# Altium project KRing.PrjPCB
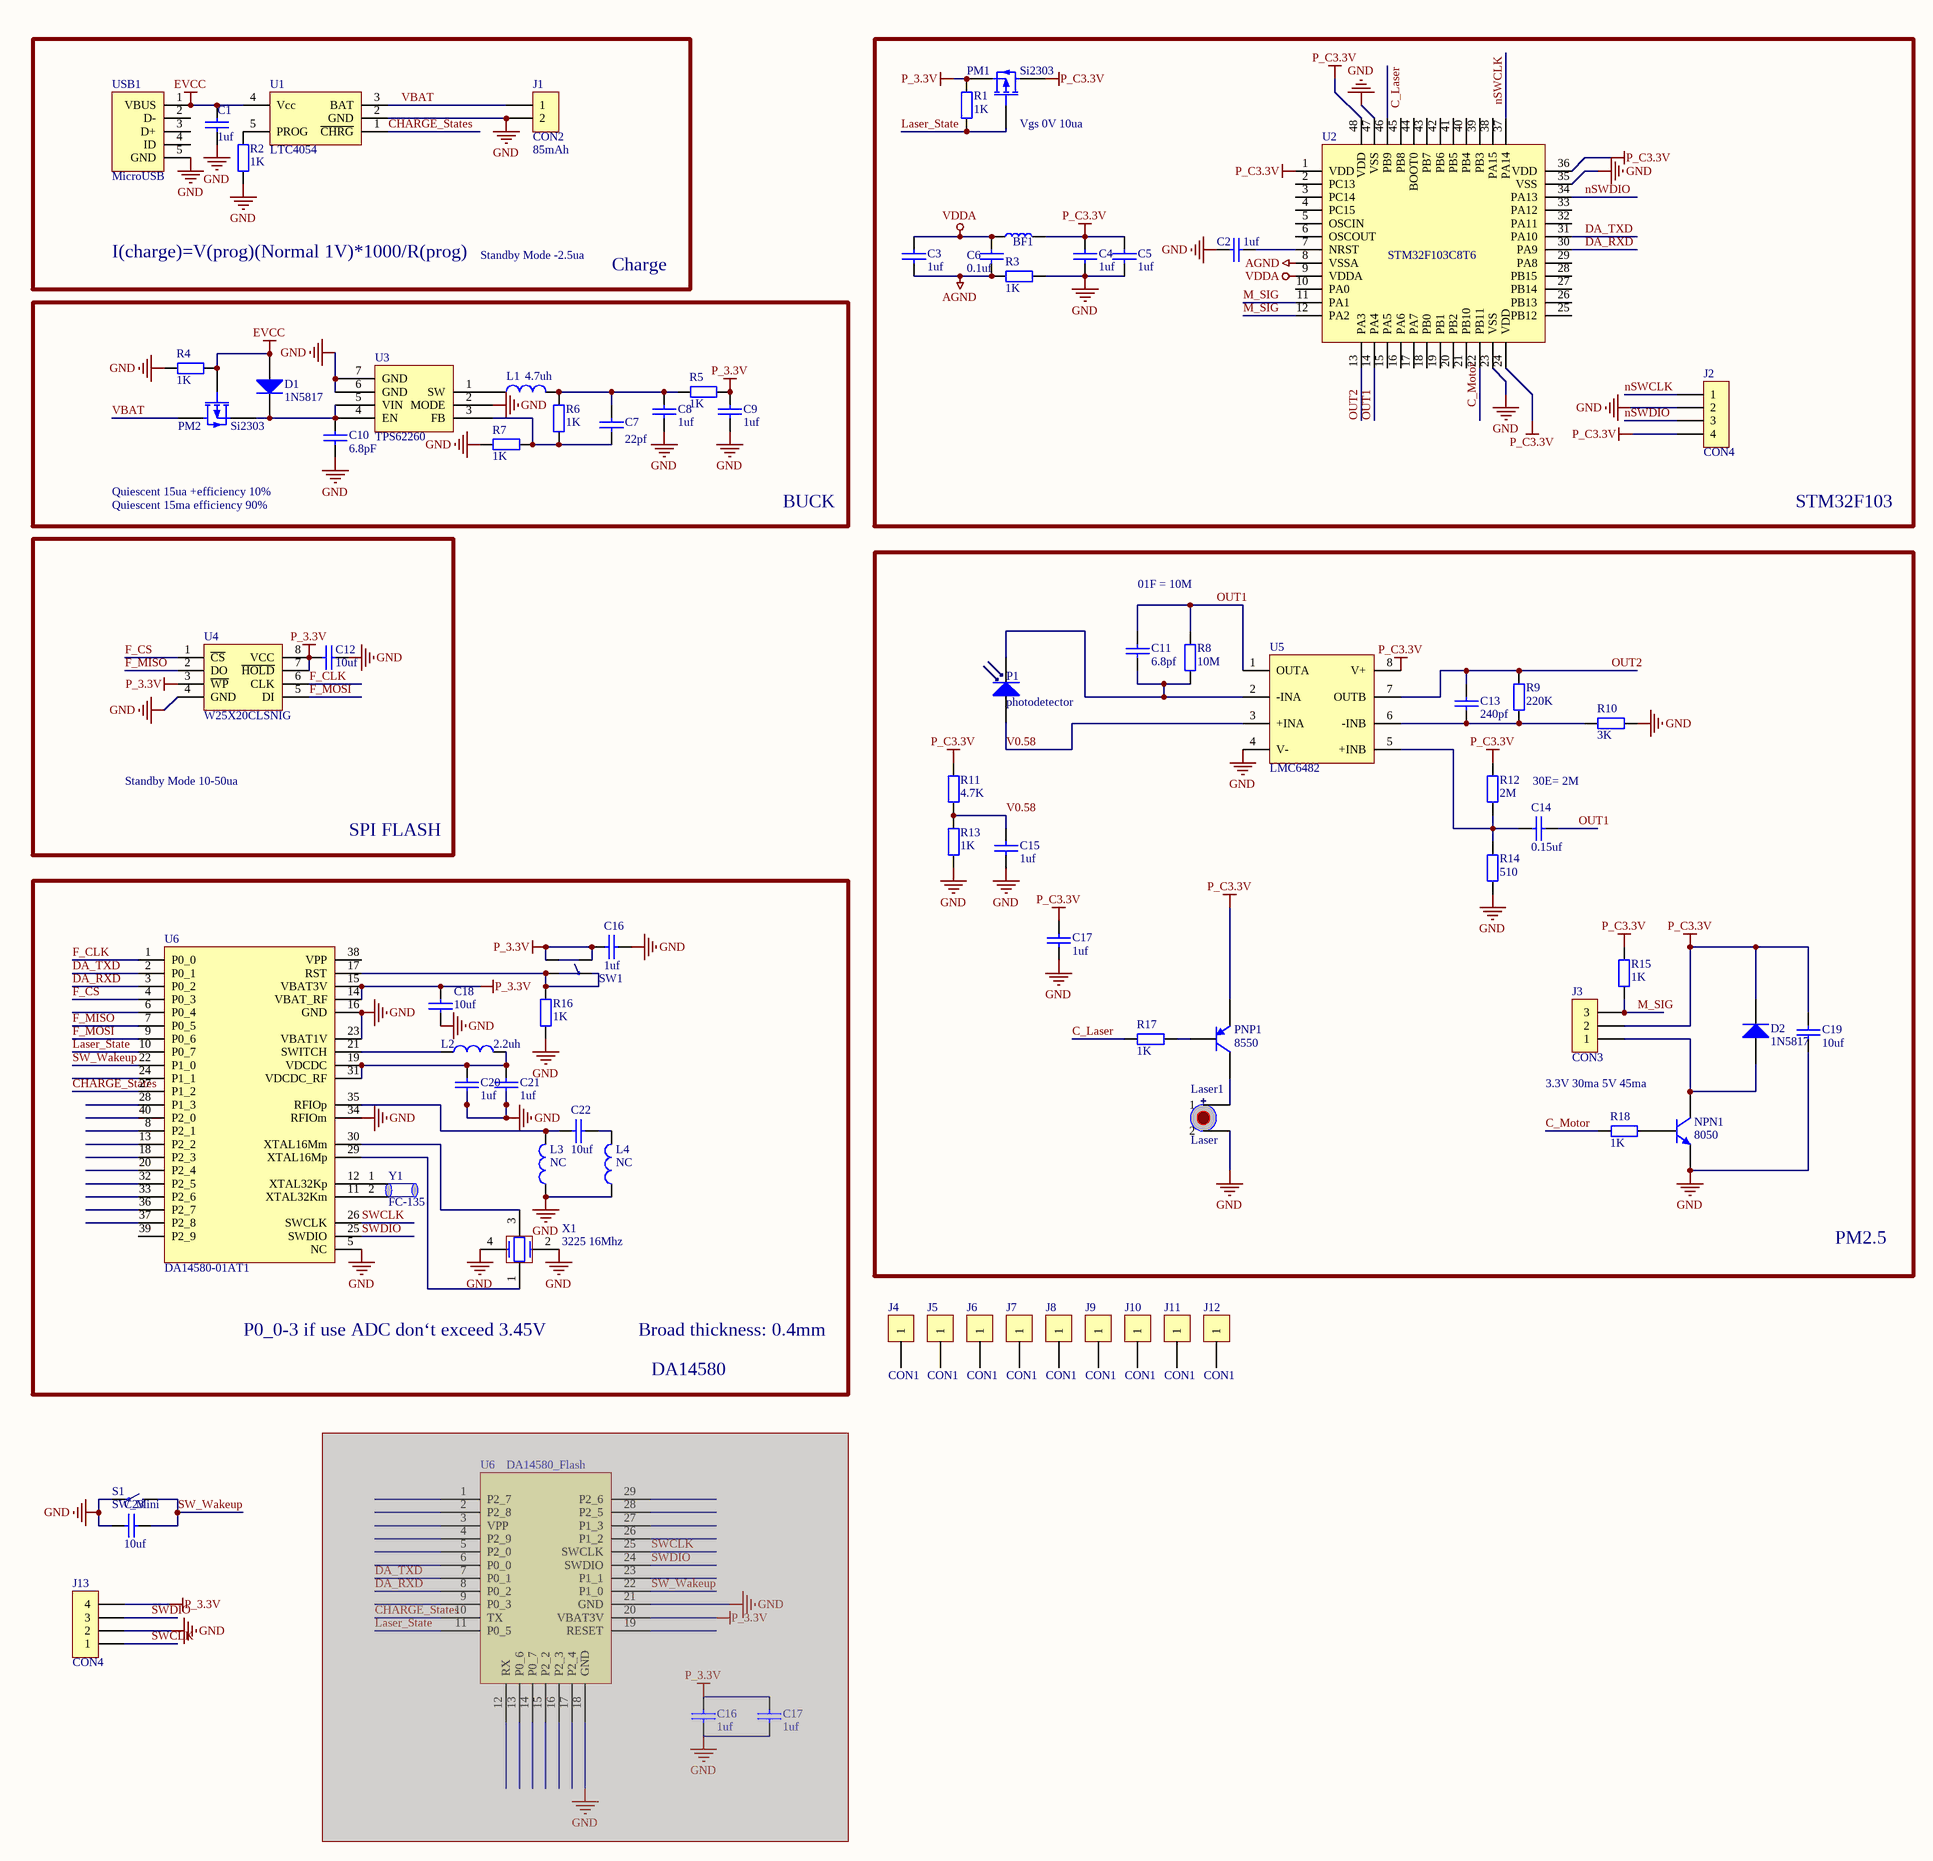
[diagram p0: KRing.SchDoc]
1 sheet, 81 parts. Net scope: global (net labels, ports and power ports of the same name join across sheets).
Board files: KRing_B1.PcbDoc, KRing_B2.PcbDoc, KRing_B2_A.PcbDoc, KRing_B3.PcbDoc, KRing_B4.PcbDoc, KRing_B4_A1.PcbDoc

## Sheet KRing.SchDoc
size A2

### Parts
(Parts that share a designator on the sheet are numbered #1, #2 ... from top to bottom, then left to right.)
BF1  BF  [R0603]  (value not drawn)
C1  1uf  [C0603]
C2  1uf  [C0603]
C3  1uf  [C0603]
C4  1uf  [C0603]
C5  1uf  [C0603]
C6  0.1uf  [C0603]
C7  22pf  [C0603]
C8  1uf  [C0603]
C9  1uf  [C0603]
C10  6.8pF  [C0603]
C11  6.8pf  [C0603]
C12  10uf  [C0603]
C13  240pf  [C0603]
C14  0.15uf  [C0603]
C15  1uf  [C0603]
C16#1  1uf  [C0603]
C16#2  1uf  [C0603]  (masked out: inside a compile mask, not in the netlist)
C17#1  1uf  [C0603]
C17#2  1uf  [C0603]  (masked out: inside a compile mask, not in the netlist)
C18  10uf  [C0603]
C19  10uf  [C0603]
C20  1uf  [C0603]
C21  1uf  [C0603]
C22  10uf  [C0603]
C23  10uf  [C0603]
D1  1N5817  [SOD323(0805)]
D2  1N5817  [SOD323(0805)]
J1  CON2  [Battry_Connector]
J2  CON4  [CON4 1mm]
J3  CON3  [Motor Connector]
J4  CON1  [2.4mm]
J5  CON1  [2.4mm]
J6  CON1  [2.4mm]
J7  CON1  [2.4mm]
J8  CON1  [2.4mm]
J9  CON1  [2.4mm]
J10  CON1  [0.5mm]
J11  CON1  [0.5mm]
J12  CON1  [6.5mm]
J13  CON4  [CON4 1mm]
L1  4.7uh  [GDNR3012]
L2  2.2uh  [L0603]
L3  NC  [L0603]
L4  NC  [L0603]
Laser1  Laser  [Battry_Connector]
NPN1  8050  [SOT23-3]
P1  photodetector  [BPW34]
PM1  Si2303  [SOT23-3]
PM2  Si2303  [SOT23-3]
PNP1  8550  [SOT23-3]
R1  1K  [R0603]
R2  1K  [R0603]
R3  1K  [R0603]
R4  1K  [R0603]
R5  1K  [R0603]
R6  1K  [R0603]
R7  1K  [R0603]
R8  10M  [R0603]
R9  220K  [R0603]
R10  3K  [R0603]
R11  4.7K  [R0603]
R12  2M  [R0603]
R13  1K  [R0603]
R14  510  [R0603]
R15  1K  [R0603]
R16  1K  [R0603]
R17  1K  [R0603]
R18  1K  [R0603]
S1  SW_Mini  [SW_Mini]
SW1  SW_MINI2  [SW_MINI2]  (value not drawn)
U1  LTC4054  [LTC4054]
U2  STM32F103C8T6  [TSQFP50P900X900X160-48L]
U3  TPS62260  [QFN2x2-6]
U4  W25X20CLSNIG  [SOIC8]
U5  LMC6482  [LMC6482]
U6#1  DA14580-01AT1  [QFN40P500X500X90_HS-41L]
U6#2  DA14580_Flash  [DA14580_Flash]  (masked out: inside a compile mask, not in the netlist)
USB1  MicroUSB  [MicroUSB]
X1  3225 16Mhz  [3225]
Y1  FC-135  [FC-135]

### Blocks framed on the sheet
STM32F103: BF1 C2-C6 J2 PM1 R1 R3 U2
BUCK: C7-C10 D1 L1 PM2 R4-R7 U3
SPI FLASH: C12 U4
PM2.5: C11 C13-C15 C17#1 C19 D2 J3 Laser1 NPN1 P1 PNP1 R8-R15 R17 R18 U5

### Nets
AGND: C3.1 C6.1 R3.2 U2.8(VSSA)
EVCC: C1.1 D1.A PM2.1(G) R4.1 U1.4(Vcc) USB1.1(VBUS)
GND: C1.2 C2.1 C4.1 C5.1 C8.2 C9.2 C10.2 C12.1 C15.2 C16#1.2 C17#1.2 C18.1 C19.1 C20.1 C21.2 C23.1 J1.2 J2.2 J13.2 L3.1 L4.1 Laser1.2 NPN1.2(E) R2.1 R3.1 R4.2 R7.2 R10.1 R13.1 R14.1 R16.2 S1.1 U1.2(GND) U2.23(VSS) U2.35(VSS) U2.47(VSS) U3.2(MODE) U3.6(GND) U3.7(GND) U4.4(GND) U5.4(V-) U6#1.5(NC) U6#1.16(GND) U6#1.23(VBAT1V) U6#1.34(RFIOm) USB1.5(GND) X1.2(XTAL_M) X1.4(XTALP)
P_3.3V: C9.1 C12.2 C16#1.1 C18.2 J13.4 PM1.2(S) R1.2 R5.1 SW1.3 SW1.4 U4.3(~{WP}) U4.7(~{HOLD}) U4.8(VCC) U6#1.14(VBAT_RF) U6#1.15(VBAT3V)
P_C3.3V: BF1.2 C4.2 C5.2 C17#1.1 C19.2 D2.C(K) J2.4 J3.2 PM1.3(D) PNP1.2(E) R11.2 R12.2 R15.2 U2.1(VDD) U2.24(VDD) U2.36(VDD) U2.48(VDD) U5.8(V+)
VDDA: BF1.1 C3.2 C6.2 U2.9(VDDA)
C_Laser: R17.2 U2.46(PB9)
C_Motor: R18.2 U2.22(PB11)
CHARGE_States: U1.1(~{CHRG}) U6#1.27(P1_2)
DA_RXD: U2.30(PA9) U6#1.3(P0_2)
DA_TXD: U2.31(PA10) U6#1.2(P0_1)
F_CLK: U4.6(CLK) U6#1.1(P0_0)
F_CS: U4.1(~{CS}) U6#1.4(P0_3)
F_MISO: U4.2(DO) U6#1.7(P0_5)
F_MOSI: U4.5(DI) U6#1.9(P0_6)
Laser_State: PM1.1(G) R1.1 U6#1.10(P0_7)
M_SIG: J3.3 R15.1 U2.11(PA1) U2.12(PA2)
nSWCLK: J2.1 U2.37(PA14)
nSWDIO: J2.3 U2.34(PA13)
OUT1: C11.1 C14.2 R8.2 U2.14(PA4) U5.1(OUTA)
OUT2: C13.1 R9.2 U2.13(PA3) U5.7(OUTB)
SW_Wakeup: C23.2 S1.2 U6#1.22(P1_0)
SWCLK: J13.1 U6#1.26(SWCLK)
SWDIO: J13.3 U6#1.25(SWDIO)
V0.58: C15.1 P1.A R11.1 R13.2 U5.3(+INA)
VBAT: J1.1 PM2.3(D) U1.3(BAT)
NetC2_2: C2.2 U2.7(NRST)
NetC7_1: C7.1 C8.1 L1.2 R5.2 R6.2
NetC7_2: C7.2 R6.1 R7.1 U3.3(FB)
NetC10_1: C10.1 D1.C(K) PM2.2(S) U3.4(EN) U3.5(VIN)
NetC11_2: C11.2 P1.C(K) R8.1 U5.2(-INA)
NetC13_2: C13.2 R9.1 R10.2 U5.6(-INB)
NetC14_1: C14.1 R12.1 R14.2 U5.5(+INB)
NetC20_1: C20.1 C21.1 L2.2 U6#1.19(VDCDC) U6#1.31(VDCDC_RF)
NetC22_1: C22.1 L3.2 U6#1.35(RFIOp)
NetC22_2: C22.2 L4.2
NetD2_A: D2.A J3.1 NPN1.3(C)
NetL1_1: L1.1 U3.1(SW)
NetL2_1: L2.1 U6#1.21(SWITCH)
NetLaser1_1: Laser1.1 PNP1.3(C)
NetNPN1_1: NPN1.1(B) R18.1
NetPNP1_1: PNP1.1(B) R17.1
NetR2_2: R2.2 U1.5(PROG)
NetR16_1: R16.1 SW1.1 SW1.2 U6#1.17(RST)
NetU6#1_11: U6#1.11(XTAL32Km) Y1.2
NetU6#1_12: U6#1.12(XTAL32Kp) Y1.1
NetU6#1_29: U6#1.29(XTAL16Mp) X1.1(GND)
NetU6#1_30: U6#1.30(XTAL16Mm) X1.3(GND)

Not connected (* = marked no-connect by the designer): J4 1; J5 1; J6 1; J7 1; J8 1; J9 1; J10 1; J11 1; J12 1; U2 2(PC13) 3(PC14) 4(PC15) 5(OSCIN) 6(OSCOUT) 10(PA0) 15(PA5) 16(PA6) 17(PA7) 18(PB0) 19(PB1) 20(PB2) 21(PB10) 25(PB12) 26(PB13) 27(PB14) 28(PB15) 29(PA8) 32(PA11) 33(PA12) 38(PA15) 39(PB3) 40(PB4) 41(PB5) 42(PB6) 43(PB7) 44(BOOT0) 45(PB8); U6#1 6(P0_4) 8(P2_1) 13(P2_2) 18(P2_3) 20(P2_4) 24(P1_1) 28(P1_3) 32(P2_5) 33(P2_6) 36(P2_7) 37(P2_8) 38(VPP) 39(P2_9) 40(P2_0); USB1 2(D-) 3(D+) 4(ID)

### Notes on the sheet
- (near PM1) Vgs 0V 10ua
- (near J1) 85mAh
- I(charge)=V(prog)(Normal 1V)*1000/R(prog)
- Standby Mode -2.5ua
- Charge
- Quiescent 15ua +efficiency 10%
- Quiescent 15ma efficiency 90%
- 01F = 10M
- Standby Mode 10-50ua
- 30E= 2M
- 3.3V 30ma 5V 45ma
- P0_0-3 if use ADC don‘t exceed 3.45V
- Broad thickness: 0.4mm
- DA14580

### Library data of the parts
BF1 = BF: 磁珠
C1-C15 C16#1 C16#2 C17#1 C17#2 C18-C23 = C: Attributes: 10V 20%  Non polar capacitor
D1 D2 = Diode: Purchase: C22623; Attributes: *
  D1: Prices: 1.11
J4-J12 = CON1: Attributes: 2.54; Purchase: *
L1 L3 L4 = L: Attributes: 1A; Purchase: http://item.taobao.com/item.htm?spm=a1z09.2.9.118.lpZDXY&id=40718839610&_u=3mljuuh496c
L2 = L: Attributes: 1A; Purchase: C1033
NPN1 = NPN: Puchase: C2146; Attributes: *
PM1 = PMOS: Purchase: C10489; Attributes: *
PM2 = PMOS: Attributes: *
PNP1 = PNP: Attributes: *
R1-R18 = R: Attributes: 5% Stacked resistance
U2 = STM32F103C8T6: Purchase: C8734; Attribute: *; Prices: 11.32/9.02/8.57/8.11
U3 = TPS62260: Attributes: 600mA 2.25Mhz; Purchase: C42214
U4 = W25X20CLSNIG: Attributes: NOR Flash SPI FLASH; Purchase: C34591
U5 = LMC6482: Purchase: C12620; Attributes: *
U6#1 = DA14580-01AT1: Attribute: QFN 40Pin; Purchase: http://item.taobao.com/item.htm?spm=a230r.1.14.60.X52rrY&id=43818350425&ns=1&abbucket=10#detail
USB1 = MicroUSB: Purchase: C10418; Attributes: *
X1 = 3225 16Mhz: Attributes: Passive; Purchase: C13738
Y1 = FC-135: Purchase: C32346; Attributes: *; Prices: 0.77
J1 = CON2: Attributes: *
J2 J13 = CON4: Attributes: *
Laser1 = Laser: Attributes: *; Purchase: *
P1 = photodetector: Attribute: *; Purchase: *
S1 = SW_Mini: Purchase: http://detail.tmall.com/item.htm?id=19820219411&spm=a1z09.2.9.33.hsCssa&_u=hmljuuh65b0
SW1 = SW_MINI2: Purchase: http://item.taobao.com/item.htm?spm=a230r.1.14.145.3fxJCW&id=39994106693&ns=1&abbucket=4#detail; Attributes: *
U1 = LTC4054: Purchase: http://detail.tmall.com/item.htm?spm=a230r.1.14.1.Wl2oSg&id=41254667951&ad_id=&am_id=&cm_id=140105335569ed55e27b&pm_id=&abbucket=10; Attributes: *
U6#2 = DA14580_Flash: Attributes: *; Purchase: *